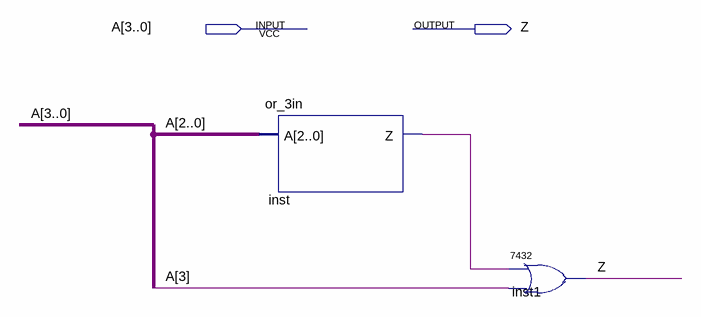
[diagram p0: schematic sheet]
// Quartus schematic or_4in.bdf as structural Verilog: 2 symbols, 2 pins
module or_4in (
  input  [3:0] A,
  output Z
);

  wire inst_z;

  or_3in inst (.A(A[2:0]), .Z(inst_z));
  \7432  inst1 (.\2 (inst_z), .\3 (A[3]), .\1 (Z));
endmodule
